# Altium schematic sheet v1.5 GPS.SchDoc
size A4; DocumentNumber: 7; SheetNumber: 7
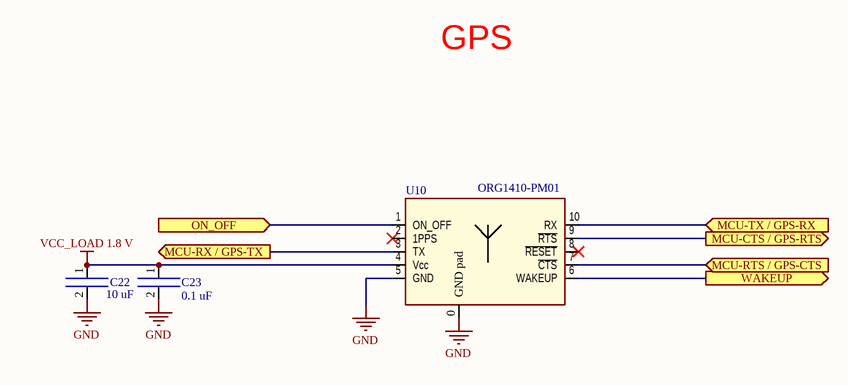
[diagram p0: v1.5 GPS.SchDoc]

## Parts
C22  10 uF  [0603]
C23  0.1 uF  [0402]
U10  ORG1410-PM01  [ORG1410-PM01]

## Ports
MCU-CTS / GPS-RTS (out), MCU-RTS / GPS-CTS (in), MCU-RX / GPS-TX (out), MCU-TX / GPS-RX (in), ON_OFF (in), WAKEUP (out)

## Nets
GND: C22.2 C23.2 U10.0(GND_pad) U10.5(GND)
VCC_LOAD 1.8 V: C22.1 C23.1 U10.4(Vcc)
MCU-CTS / GPS-RTS: U10.9(~{RTS}) ; port MCU-CTS / GPS-RTS
MCU-RTS / GPS-CTS: U10.7(~{CTS}) ; port MCU-RTS / GPS-CTS
MCU-RX / GPS-TX: U10.3(TX) ; port MCU-RX / GPS-TX
MCU-TX / GPS-RX: U10.10(RX) ; port MCU-TX / GPS-RX
ON_OFF: U10.1(ON_OFF) ; port ON_OFF
WAKEUP: U10.6(WAKEUP) ; port WAKEUP

Not connected (* = marked no-connect by the designer): U10 2(1PPS)* 8(~{RESET})*

## Notes on the sheet
- GPS

## Library data of the parts
C22 C23 = Capasistor